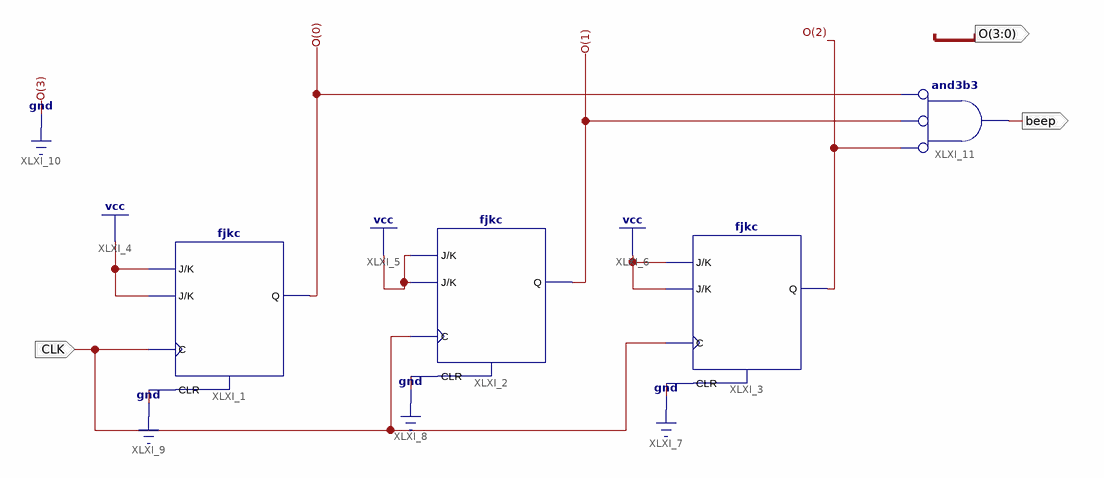
[diagram p0: schematic sheet 1]
// Xilinx ISE schematic counter1and7.sch (spartan6) as structural Verilog: 4 symbols, 3 ports
module counter1and7 (
  input  CLK,
  output [3:0] O,
  output beep
);

  fjkc XLXI_1 (.C(CLK), .CLR(1'b0), .J(1'b1), .K(1'b1), .Q(O[0]));
  fjkc XLXI_2 (.C(CLK), .CLR(1'b0), .J(1'b1), .K(1'b1), .Q(O[1]));
  fjkc XLXI_3 (.C(CLK), .CLR(1'b0), .J(1'b1), .K(1'b1), .Q(O[2]));
  and XLXI_11 (beep, ~O[2], ~O[1], ~O[0]);  // and3b3

  assign O[3] = 1'b0;
endmodule
